# Altium schematic sheet ChordlMixer.SCHDOC
size A4
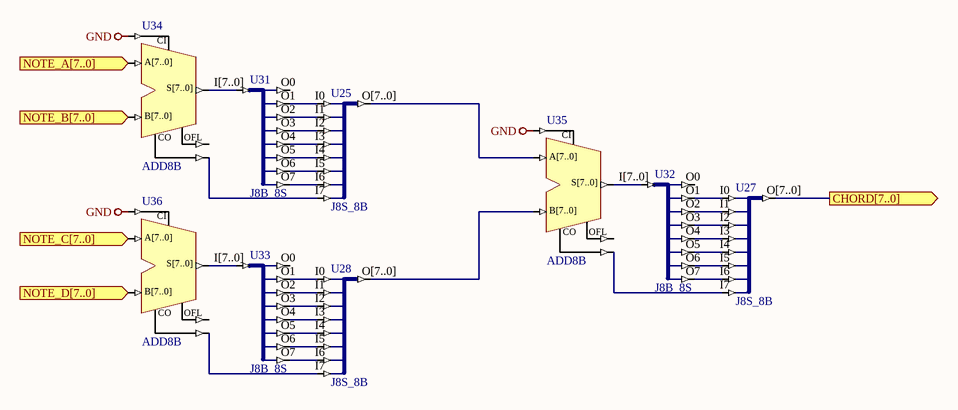
[diagram p0: ChordlMixer.SCHDOC]

## Parts
U25  J8S_8B
U27  J8S_8B
U28  J8S_8B
U31  J8B_8S
U32  J8B_8S
U33  J8B_8S
U34  ADD8B
U35  ADD8B
U36  ADD8B

## Ports
CHORD[7..0] (out), NOTE_A[7..0] (in), NOTE_B[7..0] (in), NOTE_C[7..0] (in), NOTE_D[7..0] (in)

## Nets
GND: U34.CI U35.CI U36.CI
CHORD[7..0]: U27.O[7..0] ; port CHORD[7..0]
NOTE_A[7..0]: U34.A[7..0] ; port NOTE_A[7..0]
NOTE_B[7..0]: U34.B[7..0] ; port NOTE_B[7..0]
NOTE_C[7..0]: U36.A[7..0] ; port NOTE_C[7..0]
NOTE_D[7..0]: U36.B[7..0] ; port NOTE_D[7..0]
NetU25_I0: U25.I0 U31.O1
NetU25_I1: U25.I1 U31.O2
NetU25_I2: U25.I2 U31.O3
NetU25_I3: U25.I3 U31.O4
NetU25_I4: U25.I4 U31.O5
NetU25_I5: U25.I5 U31.O6
NetU25_I6: U25.I6 U31.O7
NetU25_I7: U25.I7 U34.CO
NetU25_O[7..0]: U25.O[7..0] U35.A[7..0]
NetU27_I0: U27.I0 U32.O1
NetU27_I1: U27.I1 U32.O2
NetU27_I2: U27.I2 U32.O3
NetU27_I3: U27.I3 U32.O4
NetU27_I4: U27.I4 U32.O5
NetU27_I5: U27.I5 U32.O6
NetU27_I6: U27.I6 U32.O7
NetU27_I7: U27.I7 U35.CO
NetU28_I0: U28.I0 U33.O1
NetU28_I1: U28.I1 U33.O2
NetU28_I2: U28.I2 U33.O3
NetU28_I3: U28.I3 U33.O4
NetU28_I4: U28.I4 U33.O5
NetU28_I5: U28.I5 U33.O6
NetU28_I6: U28.I6 U33.O7
NetU28_I7: U28.I7 U36.CO
NetU28_O[7..0]: U28.O[7..0] U35.B[7..0]
NetU31_I[7..0]: U31.I[7..0] U34.S[7..0]
NetU32_I[7..0]: U32.I[7..0] U35.S[7..0]
NetU33_I[7..0]: U33.I[7..0] U36.S[7..0]

Not connected (* = marked no-connect by the designer): U31 O0; U32 O0; U33 O0; U34 OFL; U35 OFL; U36 OFL

## Library data of the parts
U25 U27 U28 = J8S_8B: 8 Single pin inputs to single 8-Bit output bus; ArchiveName: GENERIC; Published: 18-Dec-2003; Publisher: Altium Limited; Core Revision: 1.00.00
U31-U33 = J8B_8S: 8-Bit input bus to 8 single pin outputs; ArchiveName: GENERIC; Published: 18-Dec-2003; Publisher: Altium Limited; Core Revision: 1.00.00
U34-U36 = ADD8B: 8-Bit Cascadable Full Adder with Signed and Unsigned Operations, Bus Version; Xilinx Equivalent: ADD8; ArchiveName: GENERIC; Published: 18-Dec-2003; Publisher: Altium Limited; Core Revision: 1.00.00